# EAGLE schematic oled_game (EAGLE 7.6.0)
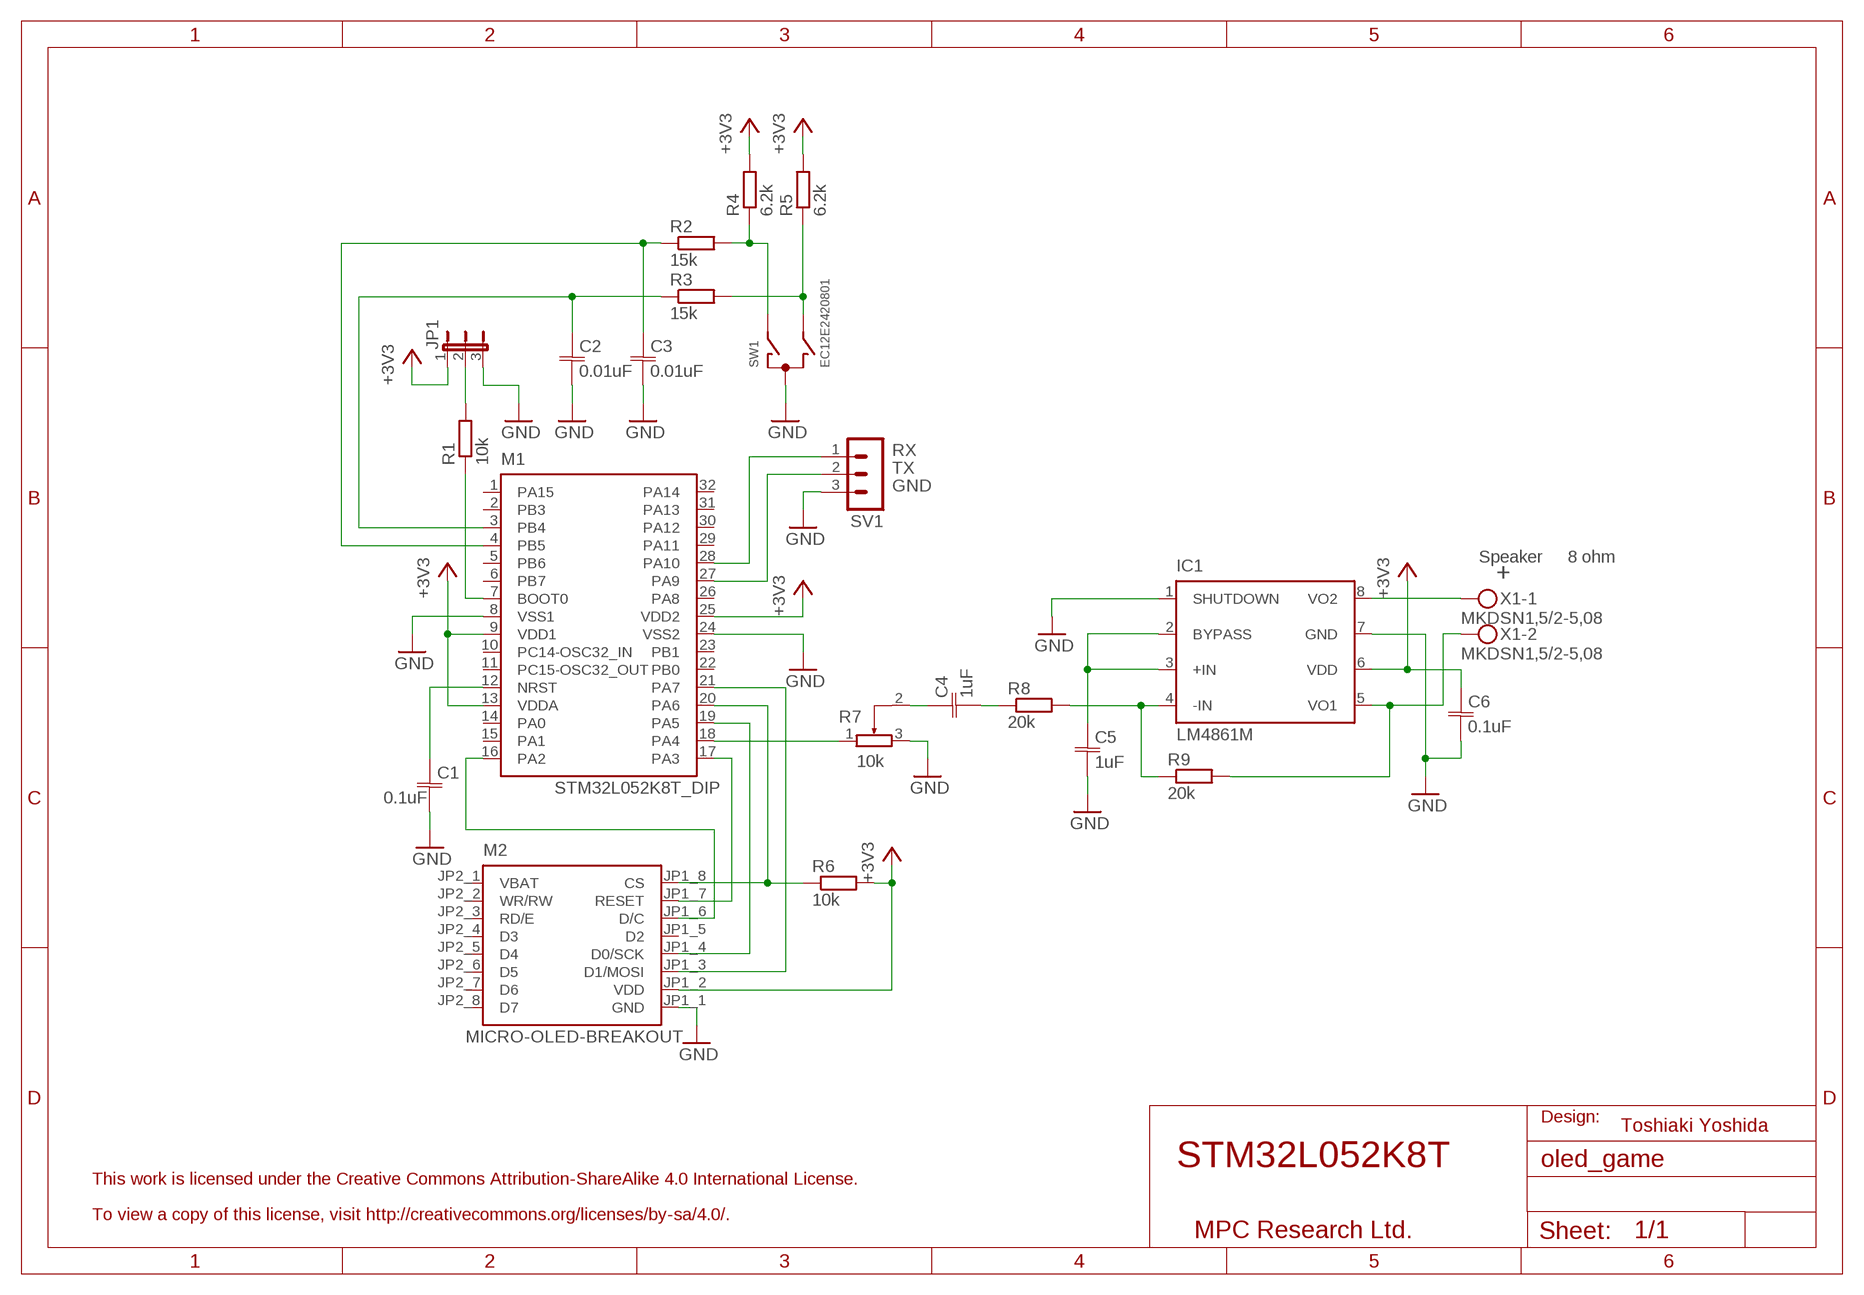
[diagram p0: schematic, sheet 1]

## Parts
C1  0.1uF  C-JIS050-024X044  [C050-024X044]
C2  0.01uF  C-JIS050-024X044  [C050-024X044]
C3  0.01uF  C-JIS050-024X044  [C050-024X044]
C4  1uF  C-JIS050-024X044  [C050-024X044]
C5  1uF  C-JIS050-024X044  [C050-024X044]
C6  0.1uF  C-JIS050-024X044  [C050-024X044]
IC1  LM4861M  [SO-08]
JP1  JP2E  [JP2]
M1  STM32L052K8T_DIP  [DIP32]
M2  MICRO-OLED-BREAKOUT  [MICRO-OLED-BREAKOUT]
R1  10k  R-EU_0207/2V  [0207/2V]
R2  15k  R-EU_0207/2V  [0207/2V]
R3  15k  R-EU_0207/2V  [0207/2V]
R4  6.2k  R-EU_0207/2V  [0207/2V]
R5  6.2k  R-EU_0207/2V  [0207/2V]
R6  10k  R-EU_0207/2V  [0207/2V]
R7  10k  TSR-3386T-EY5  [TSR-3386T]
R8  20k  R-EU_0207/2V  [0207/2V]
R9  20k  R-EU_0207/10  [0207/10]
SV1  MA03-1  [MA03-1]
SW1  EC12E2420801  EC12E_SW  [ALPS_EC12E_SW]
X1  MKDSN1,5/2-5,08  [MKDSN1,5/2-5,08]

## Nets
+3V3: C6.1 IC1.6(VDD) JP1.1 M1.9(VDD1) M1.13(VDDA) M1.25(VDD2) M2.JP1_2(VDD) R4.2 R5.2 R6.2
GND: C1.2 C2.2 C3.2 C5.2 C6.2 IC1.1(SHUTDOWN) IC1.7(GND) JP1.3 M1.8(VSS1) M1.24(VSS2) M2.JP1_1(GND) R7.3 SV1.3 SW1.C
N$1: M1.27(PA9) SV1.2
N$2: M1.7(BOOT0) R1.1
N$3: M1.28(PA10) SV1.1
N$4: C1.1 M1.12(NRST)
N$5: R2.2 R4.1 SW1.A
N$6: JP1.2 R1.2
N$7: C3.1 M1.4(PB5) R2.1
N$8: R3.2 R5.1 SW1.B
N$9: C2.1 M1.3(PB4) R3.1
N$10: M1.18(PA4) R7.1
N$11: M1.16(PA2) M2.JP1_6(D/C)
N$12: M1.17(PA3) M2.JP1_7(RESET)
N$13: M1.19(PA5) M2.JP1_4(D0/SCK)
N$14: C4.1 R7.2
N$15: M1.20(PA6) M2.JP1_8(CS) R6.1
N$16: IC1.4(-IN) R8.2 R9.1
N$17: C4.2 R8.1
N$18: C5.1 IC1.2(BYPASS) IC1.3(+IN)
N$19: M1.21(PA7) M2.JP1_3(D1/MOSI)
N$20: IC1.5(VO1) R9.2 X1.2
N$26: IC1.8(VO2) X1.1
Unconnected: M1.1(PA15) M1.2(PB3) M1.5(PB6) M1.6(PB7) M1.10(PC14-OSC32_IN) M1.11(PC15-OSC32_OUT) M1.14(PA0) M1.15(PA1) M1.22(PB0) M1.23(PB1) M1.26(PA8) M1.29(PA11) M1.30(PA12) M1.31(PA13) M1.32(PA14) M2.JP1_5(D2) M2.JP2_2(WR/RW) M2.JP2_3(RD/E) M2.JP2_4(D3) M2.JP2_5(D4) M2.JP2_6(D5) M2.JP2_7(D6) M2.JP2_8(D7) SW1.D SW1.E SW1.GND1(G) SW1.GND2(G)

## Notes on the sheet
- RX
- TX
- GND
- Speaker | 8 ohm
- +
- Design:
- Toshiaki Yoshida
- STM32L052K8T
- This work is licensed under the Creative Commons Attribution-ShareAlike 4.0 International License.
- To view a copy of this license, visit http://creativecommons.org/licenses/by-sa/4.0/.
- MPC Research Ltd.

## Power pins joined to a net without a drawn wire
VBAT: M2.JP2_1(VBAT)

## Library data of the parts
C1-C6 = cap:C-JIS: CAPACITOR, Japanese symbol
IC1 = ti:LM4861M: 1.1W Audio Power Amplifier with Shutdown Mode
JP1 = jumper:JP2E: JUMPER
M1 = stm32:STM32L052K8T_DIP
M2 = sparkfun:MICRO-OLED-BREAKOUT: Micro OLED Breakout 0.66" 64 x 48 OLED module
R1-R6 R8 R9 = resistor:R-EU_: RESISTOR, European symbol
R7 = pot:TSR-3386T-EY5
SV1 = con-lstb:MA03-1: PIN HEADER; OC_FARNELL: unknown; OC_NEWARK: unknown
SW1 = switch-alps:EC12E_SW: ALPS rotary Encoder EC12E series with switch; MPN: EC12E2424407; OC_FARNELL: 1520813; OC_NEWARK: 74M1068
X1 = con-phoenix-508:MKDSN1,5/2-5,08: MKDSN 1,5/ 2-5,08 Printklemme Nennstrom: 13,5 A Nennspannung: 250 V Rastermaß: 5,08 mm Polzahl: 2 Anschlussart: Schraubanschluss Montage: Löten Anschlussrichtung Leiter/Platine: 0 ° Artikelnummer: 1729128 Source: http://eshop.phoenixcontact.com .. 1729128.pdf